# Altium schematic sheet MP3Player.SchDoc
size A2
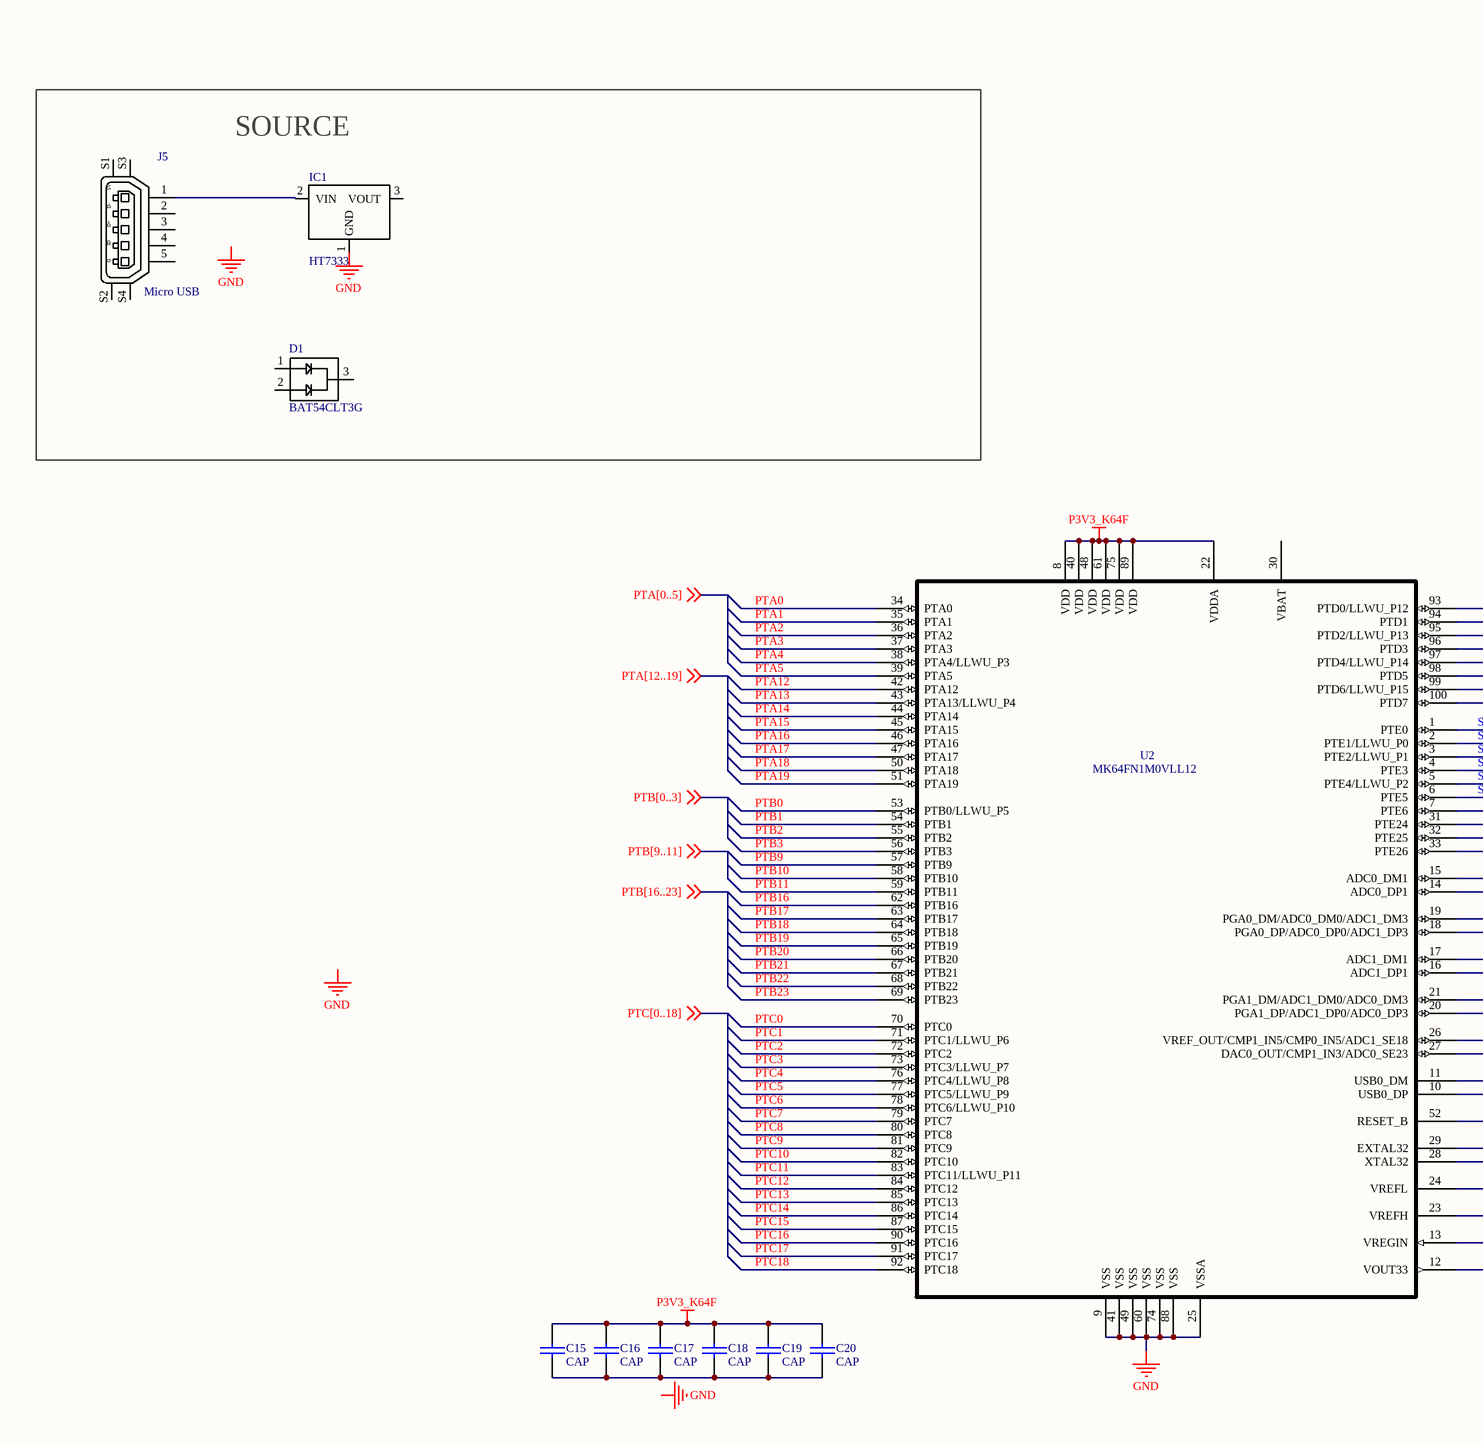
[diagram p0: MP3Player.SchDoc, left]
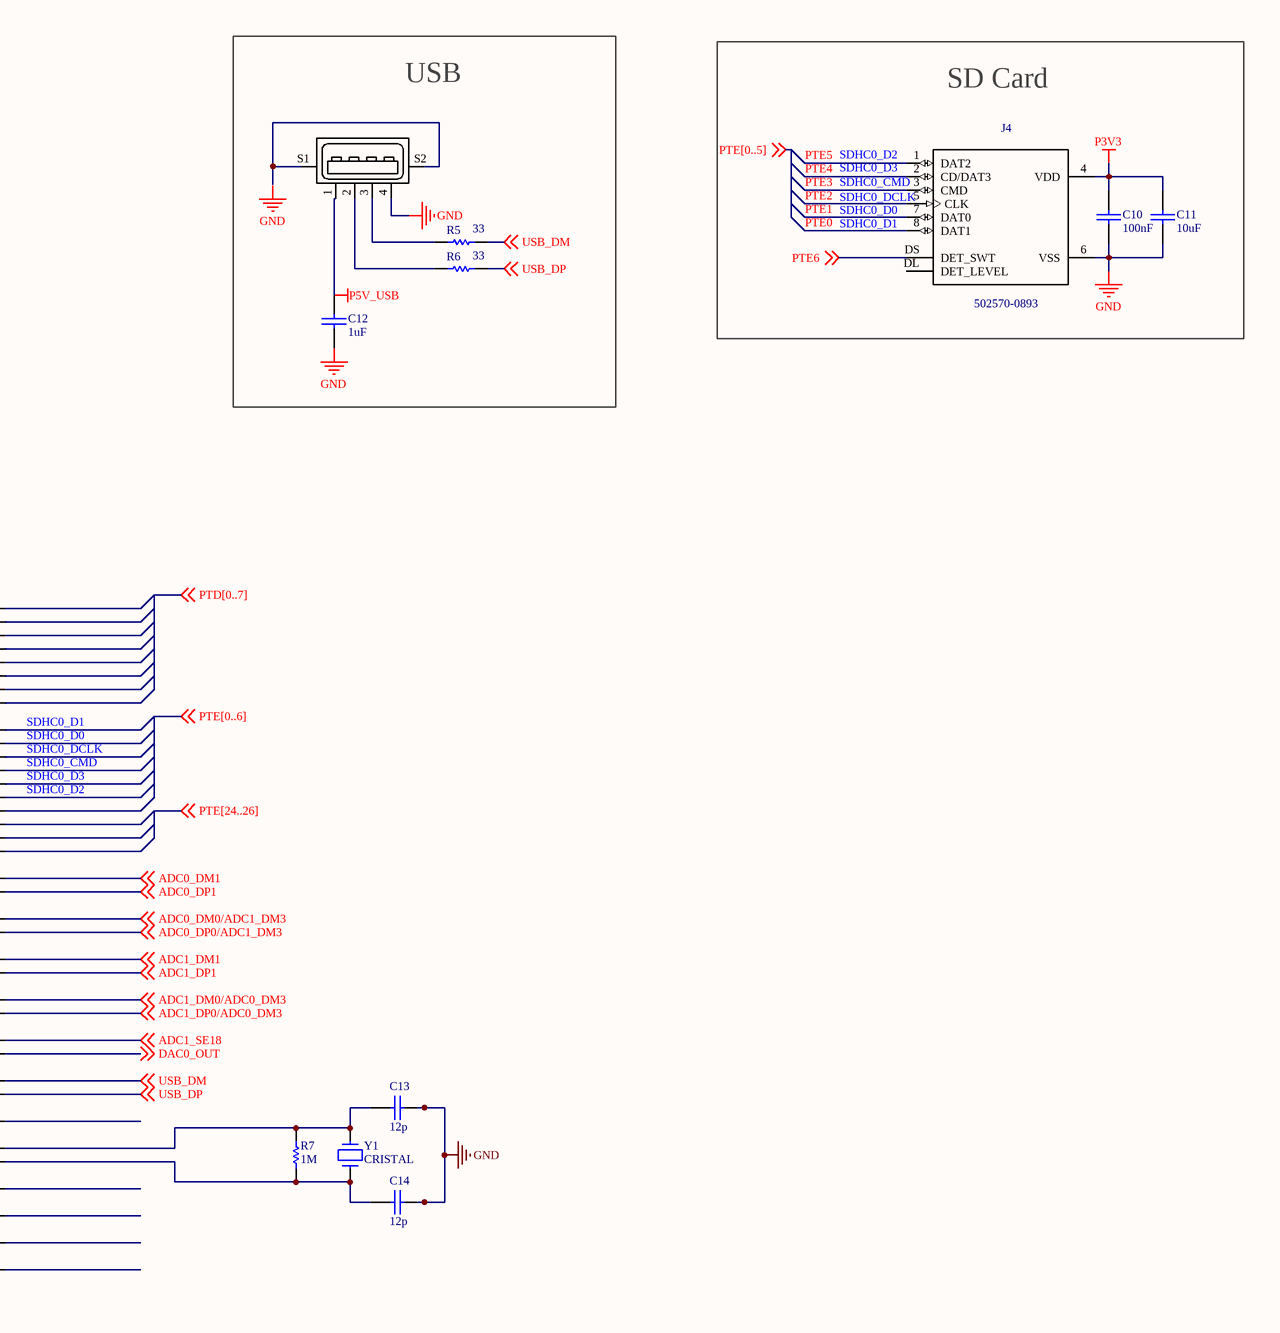
[diagram p1: MP3Player.SchDoc, right]

## Parts
C10  100nF  [0805]
C11  10uF  [0805]
C12  1uF  [0805]
C13  12p  [0805]
C14  12p  [0805]
C15  CAP  [0805]
C16  CAP  [0805]
C17  CAP  [0805]
C18  CAP  [0805]
C19  CAP  [0805]
C20  CAP  [0805]
D1  BAT54CLT3G  [SOT96P237X111-3N]
IC1  HT7333
J3  UJ2-AH-1-SMT  [CUI_UJ2-AH-1-SMT_UJ2-AH-1-SMT(Primary)]  (value not drawn)
J4  502570-0893  [MOLEX_502570-0893_502570-0893(Primary)]
J5  Micro USB  [HRS_ZX62D-B-5P8_ZX62D-B-5P8(Primary)]
R5  33  [0805]
R6  33  [0805]
R7  1M  [RES400]
U2  MK64FN1M0VLL12  [LQFP-100_14X14X1]
Y1  CRISTAL  [CRISTAL PERFIL]

## Blocks framed on the sheet
USB: C12 J3 R5 R6
SD Card: C10 C11 J4
SOURCE: D1 IC1 J5

## Nets
GND: C10.2 C11.2 C12.2 C13.2 C14.2 IC1.1(GND) J3.4 J4.6(VSS) U2.9(VSS) U2.25(VSSA) U2.41(VSS) U2.49(VSS) U2.60(VSS) U2.74(VSS) U2.88(VSS)
P3V3: C10.1 C11.1 J4.4(VDD)
P3V3_K64F: C15.1 C16.1 C17.1 C18.1 C19.1 C20.1 U2.8(VDD) U2.22(VDDA) U2.40(VDD) U2.48(VDD) U2.61(VDD) U2.75(VDD) U2.89(VDD)
ADC0_DM0/ADC1_DM3: U2.19(PGA0_DM/ADC0_DM0/ADC1_DM3) ; off-sheet ADC0_DM0/ADC1_DM3
ADC0_DM1: U2.15(ADC0_DM1) ; off-sheet ADC0_DM1
ADC0_DP0/ADC1_DM3: U2.18(PGA0_DP/ADC0_DP0/ADC1_DP3) ; off-sheet ADC0_DP0/ADC1_DM3
ADC0_DP1: U2.14(ADC0_DP1) ; off-sheet ADC0_DP1
ADC1_DM0/ADC0_DM3: U2.21(PGA1_DM/ADC1_DM0/ADC0_DM3) ; off-sheet ADC1_DM0/ADC0_DM3
ADC1_DM1: U2.17(ADC1_DM1) ; off-sheet ADC1_DM1
ADC1_DP0/ADC0_DM3: U2.20(PGA1_DP/ADC1_DP0/ADC0_DP3) ; off-sheet ADC1_DP0/ADC0_DM3
ADC1_DP1: U2.16(ADC1_DP1) ; off-sheet ADC1_DP1
ADC1_SE18: U2.26(VREF_OUT/CMP1_IN5/CMP0_IN5/ADC1_SE18) ; off-sheet ADC1_SE18
DAC0_OUT: U2.27(DAC0_OUT/CMP1_IN3/ADC0_SE23) ; off-sheet DAC0_OUT
PTA0: U2.34(PTA0)
PTA1: U2.35(PTA1)
PTA2: U2.36(PTA2)
PTA3: U2.37(PTA3)
PTA4: U2.38(PTA4/LLWU_P3)
PTA5: U2.39(PTA5)
PTA12: U2.42(PTA12)
PTA13: U2.43(PTA13/LLWU_P4)
PTA14: U2.44(PTA14)
PTA15: U2.45(PTA15)
PTA16: U2.46(PTA16)
PTA17: U2.47(PTA17)
PTA18: U2.50(PTA18)
PTA19: U2.51(PTA19)
PTB0: U2.53(PTB0/LLWU_P5)
PTB1: U2.54(PTB1)
PTB2: U2.55(PTB2)
PTB3: U2.56(PTB3)
PTB9: U2.57(PTB9)
PTB10: U2.58(PTB10)
PTB11: U2.59(PTB11)
PTB16: U2.62(PTB16)
PTB17: U2.63(PTB17)
PTB18: U2.64(PTB18)
PTB19: U2.65(PTB19)
PTB20: U2.66(PTB20)
PTB21: U2.67(PTB21)
PTB22: U2.68(PTB22)
PTB23: U2.69(PTB23)
PTC0: U2.70(PTC0)
PTC1: U2.71(PTC1/LLWU_P6)
PTC2: U2.72(PTC2)
PTC3: U2.73(PTC3/LLWU_P7)
PTC4: U2.76(PTC4/LLWU_P8)
PTC5: U2.77(PTC5/LLWU_P9)
PTC6: U2.78(PTC6/LLWU_P10)
PTC7: U2.79(PTC7)
PTC8: U2.80(PTC8)
PTC9: U2.81(PTC9)
PTC10: U2.82(PTC10)
PTC11: U2.83(PTC11/LLWU_P11)
PTC12: U2.84(PTC12)
PTC13: U2.85(PTC13)
PTC14: U2.86(PTC14)
PTC15: U2.87(PTC15)
PTC16: U2.90(PTC16)
PTC17: U2.91(PTC17)
PTC18: U2.92(PTC18)
PTE0: J4.8(DAT1)
PTE1: J4.7(DAT0)
PTE2: J4.5(CLK)
PTE3: J4.3(CMD)
PTE4: J4.2(CD/DAT3)
PTE5: J4.1(DAT2)
PTE6: J4.DS(DET_SWT) ; off-sheet PTE6
USB_DM: R5.1 U2.11(USB0_DM) ; off-sheet USB_DM
USB_DP: R6.1 U2.10(USB0_DP) ; off-sheet USB_DP
NetC12_1: C12.1 J3.1
NetC13_1: C13.1 R7.2 U2.29(EXTAL32) Y1.2
NetC14_1: C14.1 R7.1 U2.28(XTAL32) Y1.1
NetC15_2: C15.2 C16.2 C17.2 C18.2 C19.2 C20.2
NetIC1_2: IC1.2(VIN) J5.1
NetJ3_2: J3.2 R6.2
NetJ3_3: J3.3 R5.2
NetJ3_S1: J3.S1(SHIELD) J3.S2(SHIELD)

Not connected (* = marked no-connect by the designer): D1 1(A1) 2(A2) 3(K); IC1 3(VOUT); J4 DL(DET_LEVEL); J5 2 3 4 5 S1(SHIELD) S2(SHIELD) S3(SHIELD) S4(SHIELD); U2 1(PTE0) 2(PTE1/LLWU_P0) 3(PTE2/LLWU_P1) 4(PTE3) 5(PTE4/LLWU_P2) 6(PTE5) 7(PTE6) 12(VOUT33) 13(VREGIN) 23(VREFH) 24(VREFL) 30(VBAT) 31(PTE24) 32(PTE25) 33(PTE26) 52(RESET_B) 93(PTD0/LLWU_P12) 94(PTD1) 95(PTD2/LLWU_P13) 96(PTD3) 97(PTD4/LLWU_P14) 98(PTD5) 99(PTD6/LLWU_P15) 100(PTD7)

## Notes on the sheet
- (near J4) SDHC0_D3
- (near J4) SDHC0_D2
- (near J4) SDHC0_D0
- (near J4) SDHC0_DCLK
- (near J4) SDHC0_CMD
- (near J4) SDHC0_D1
- SDHC0_D1
- SDHC0_D0
- SDHC0_DCLK
- SDHC0_CMD
- SDHC0_D3
- SDHC0_D2
- Labels drawn without touching a wire or pin: GND, P5V_USB
- (in symbol ZX62D-B-5P8) G         ID         D+        D-         5V

## Library data of the parts
C10-C14 = CAP
D1 = BAT54CLT3G: Manufacturer_Name: ON Semiconductor; Geometry.Height: 1.11mm; Mouser Part Number: 863-BAT54CLT3G; Manufacturer_Part_Number: BAT54CLT3G; Datasheet Link: https://componentsearchengine.com/Datasheets/1/BAT54CLT3G.pdf
IC1 = HT7333: Micropower Voltage  Regulator
J3 = UJ2-AH-1-SMT: Standard A type 4 pin Horizontal 3 Âµin Plating SMT USB 2.0 Jack; MP: UJ2-AH-1-SMT-TR; MF: CUI Inc.; CUI_purchase_URL: https://www.cui.com/product/interconnect/usb-connectors/type-a/uj2-ah-smt-series?utm_source=snapeda.com&utm_medium=referral&utm_campaign=snapedaBOM; Package: None; Availability: Unavailable; SnapEDA_Link: https://www.snapeda.com/parts/UJ2-AH-1-SMT-TR/CUI%20Inc./view-part/?ref=snap; Price: None; Value: *
J4 = 502570-0893: 1.10mm Pitch microSD Memory Card Connector, Normal Mount Surface Mount, Push-Push Type; MF: Molex; Availability: Unavailable; Package: None; SnapEDA_Link: https://www.snapeda.com/parts/502570-0893/Molex/view-part/?ref=snap; MP: 502570-0893; Price: None; Value: *
J5 = ZX62D-B-5P8: SMD+DIP Micro USB; MICRO-B-SMD; MF: Hirose; Package: None; Price: None; Availability: Unavailable; MP: ZX62D-B-5P8; SnapEDA_Link: https://www.snapeda.com/parts/ZX62D-B-5P8/Hirose%20Electric%20Co%20Ltd/view-part/?ref=snap; Value: *
R5-R7 = RES
U2 = MK64FN1M0VLL12: Imported; Vendor: FREESCALE; CPU: ARM Cortex-M4F; Max_Frequency: 120; Flash_KB: 1024; SRAM_KB: 256; Pin_Count: 100; Manufacturer_Part_Number: mk64fn1m0vll12; Package: LQFP; RefDes: RefDes; Type: Type; Value: Value